# Altium schematic sheet dc dc жарить панели.SchDoc
size A3; SheetNumber: 2; SheetTotal: 6
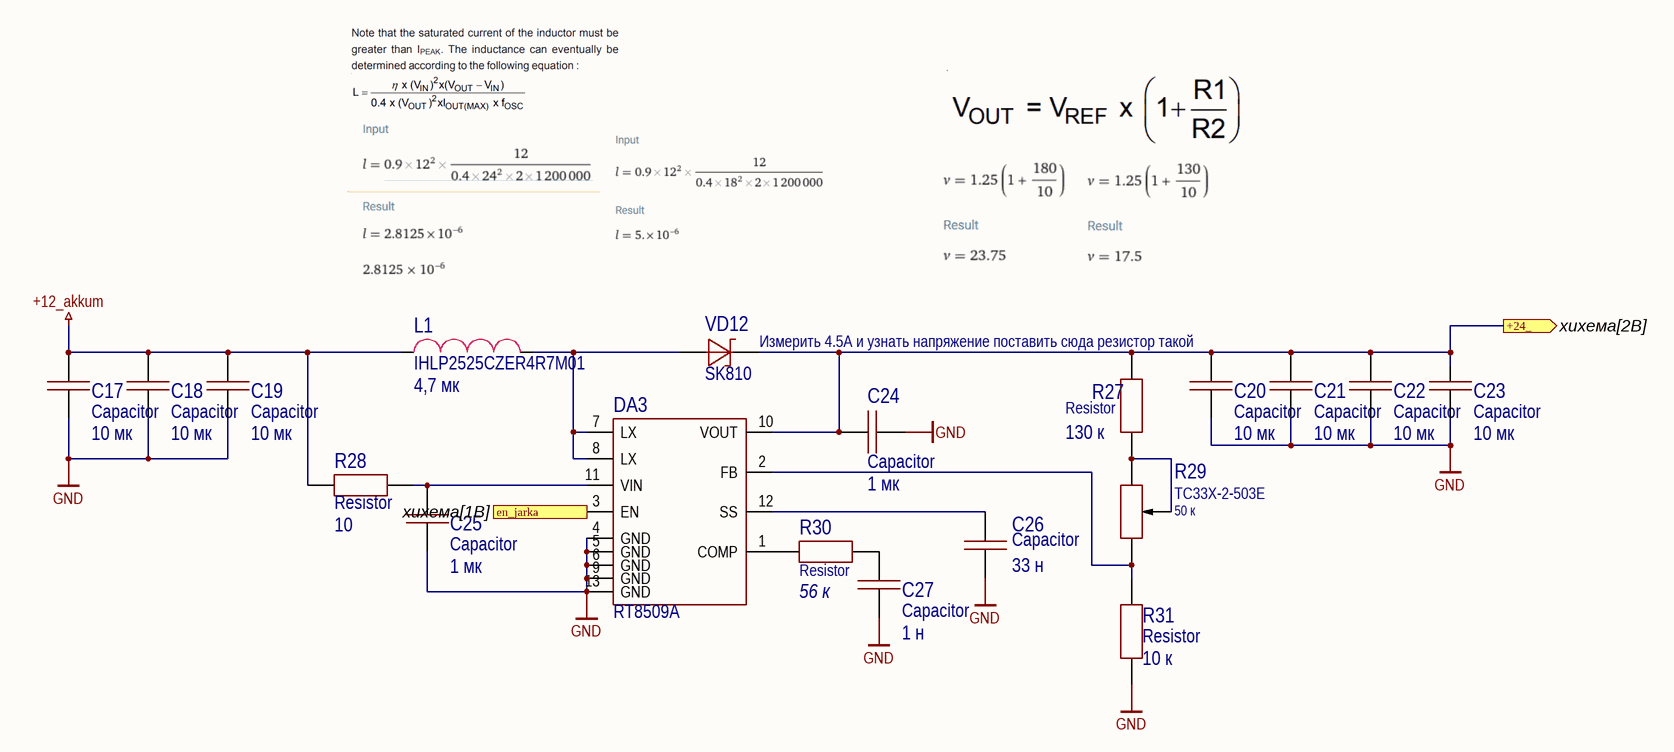
[diagram p0: dc dc жарить панели.SchDoc]

## Parts
C17  Capacitor  value 10 мк  [1210C]
C18  Capacitor  value 10 мк  [1210C]
C19  Capacitor  value 10 мк  [1210C]
C20  Capacitor  value 10 мк  [1210C]
C21  Capacitor  value 10 мк  [1210C]
C22  Capacitor  value 10 мк  [1210C]
C23  Capacitor  value 10 мк  [1210C]
C24  Capacitor  value 1 мк  [0603C]
C25  Capacitor  value 1 мк  [0603C]
C26  Capacitor  value 33 н  [0603C]
C27  Capacitor  value 1 н  [0603C]
DA3  RT8509A  [WDFN5x5-12]
L1  IHLP2525CZER4R7M01  value 4,7 мк  [IHLP-2525]
R27  Resistor  value 130 к  [0603R]
R28  Resistor  value 10  [0603R]
R29  TC33X-2-503E  value 50 к  [3mm_trim]
R30  Resistor  value 56 к  [0603R]
R31  Resistor  value 10 к  [0603R]
VD12  SK810  [SMC]

## Ports
+24_ (out, see хихема[2B]), en_jarka (in, see хихема[1B])

## Nets
+12_akkum: C17.2 C18.2 C19.2 L1.1 R28.2
GND: C17.1 C18.1 C19.1 C20.1 C21.1 C22.1 C23.1 C24.2 C25.1 C26.2 C27.1 DA3.4(GND) DA3.5(GND) DA3.6(GND) DA3.9(GND) DA3.13(GND) R31.2
+24_: C20.2 C21.2 C22.2 C23.2 C24.1 DA3.10(VOUT) R27.2 VD12.2 ; port +24_
en_jarka: DA3.3(EN) ; port en_jarka
NetC25_2: C25.2 DA3.11(VIN) R28.1
NetC26_1: C26.1 DA3.12(SS)
NetC27_2: C27.2 R30.2
NetDA3_1: DA3.1(COMP) R30.1
NetDA3_2: DA3.2(FB) R29.3 R31.1
NetDA3_7: DA3.7(LX) DA3.8(LX) L1.2 VD12.1
NetR27_1: R27.1 R29.1 R29.2

## Notes on the sheet
- Измерить 4.5А и узнать напряжение поставить сюда резистор такой

## Library data of the parts
C17-C23 = Capacitor_10u_10_35V_X7R_1210C: Конденсатор; Tolerance: 0,1; Voltage (V): 35; Dielectric: X7R; Capacity (nF): 10000; Part Number: Capacitor_10u_10_35V_X7R_1210C
C24 C25 = Capacitor_1u_10_50V_X7R_0603C: Конденсатор; Tolerance: 0,1; Voltage (V): 50; Dielectric: X7R; Capacity (nF): 1000; Part Number: Capacitor_1u_10_50V_X7R_0603C
C26 = Capacitor_33n_10_50V_X7R_0603C: Конденсатор; Tolerance: 0,1; Voltage (V): 50; Dielectric: X7R; Capacity (nF): 33; Part Number: Capacitor_33n_10_50V_X7R_0603C
C27 = Capacitor_1n_10_50V_X7R_0603C: Конденсатор; Tolerance: 0,1; Voltage (V): 50; Dielectric: X7R; Capacity (nF): 1; Part Number: Capacitor_1n_10_50V_X7R_0603C
DA3 = RT8509A: Импульсный повышающий DC-DC стабилизатор, регулируемый, 2.8В-14В (Vin), 24В/4.5A, 1.5МГц, WDFN-12; Part Number: RT8509A
L1 = IHLP2525CZER4R7M01: ЧИП-индуктивность экранированная 4,7мкГн ±20% 5,5A 40мОм 2525; Inductance (μH): 4,7; Current (A): 5,5; Part Number: IHLP2525CZER4R7M01
R27 = Resistor_130k_1_0603: Резистор номиналом 130 кОм и точностью 1%; Power: *; Part Number: Resistor_130k_1_0603; Tolerance: 1%
R28 = Resistor_10_1_0603: Резистор номиналом 10 Ом и точностью 1%; Power: *; Part Number: Resistor_10_1_0603; Tolerance: 1%
R29 = TC33X-2-503E: Потенциометр однооборотный керметный 50кОм 0.1Вт ±25% SMD лента на катушке; Tolerance: 50%; Part Number: TC33X-2-503E
R30 = Resistor_56k_1_0603: Резистор номиналом 56 кОм и точностью 1%; Power: *; Part Number: Resistor_56k_1_0603; Tolerance: 1%
R31 = Resistor_10k_1_0603: Резистор номиналом 10 кОм и точностью 1%; Power: *; Part Number: Resistor_10k_1_0603; Tolerance: 1%
VD12 = SK810: Диод шоттки на 100 В, ном. ток 8 А; Voltage nominal (V): 100; Current (A): 8; Part Number: SK810